# Altium project Atmega328p_Breakout.PrjPcb
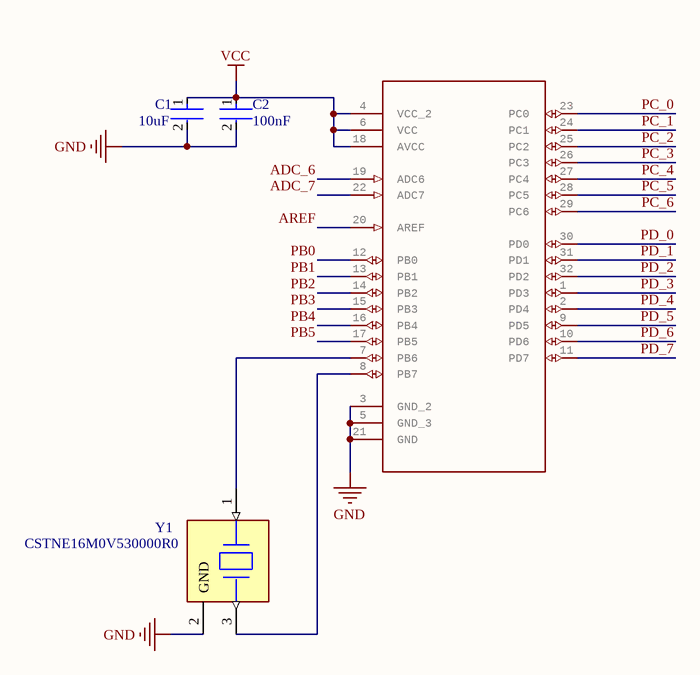
[diagram p0: Atmega328p_Breakout.SchDoc]
1 sheet, 4 parts. Net scope: global (net labels, ports and power ports of the same name join across sheets).
Board file: Atmega328p_Breakout.PcbDoc

## Sheet Atmega328p_Breakout.SchDoc
size A; SheetNumber: 1; SheetTotal: 1

### Parts
C1  10uF  [FP-CC0805-0_85-MFG]
C2  100nF  [FP-CC0805-0_85-MFG]
U1  ATMEL-ATMEGA328P-AU_ATMEGA328P-AU  [ATMEL-ATMEGA328P-AU_QFP80P900X900X120-32N]  (value not drawn)
Y1  CSTNE16M0V530000R0  [FP-CSTNE16M0V530000R0-MFG]

### Nets
GND: C1.2 C2.2 U1.3(GND_2) U1.5(GND_3) U1.21(GND) Y1.2(GND)
VCC: C1.1 C2.1 U1.4(VCC_2) U1.6(VCC) U1.18(AVCC)
ADC_6: U1.19(ADC6)
ADC_7: U1.22(ADC7)
AREF: U1.20(AREF)
PB0: U1.12(PB0)
PB1: U1.13(PB1)
PB2: U1.14(PB2)
PB3: U1.15(PB3)
PB4: U1.16(PB4)
PB5: U1.17(PB5)
PC_0: U1.23(PC0)
PC_1: U1.24(PC1)
PC_2: U1.25(PC2)
PC_3: U1.26(PC3)
PC_4: U1.27(PC4)
PC_5: U1.28(PC5)
PC_6: U1.29(PC6)
PD_0: U1.30(PD0)
PD_1: U1.31(PD1)
PD_2: U1.32(PD2)
PD_3: U1.1(PD3)
PD_4: U1.2(PD4)
PD_5: U1.9(PD5)
PD_6: U1.10(PD6)
PD_7: U1.11(PD7)
NetU1_7: U1.7(PB6) Y1.1(Input)
NetU1_8: U1.8(PB7) Y1.3(Output)

### Library data of the parts
C1 = CMP-2100-03606-3: CAP CER 0.1UF 50V X7R 0805; Manufacturer Part Number: CC0805KRX7R9BB104; Manufacturer: Yageo; Tolerance: 0.1; Capacitance: 100 nF; Value: 100 nF; Description: CC0805 100 nF X7R 10.00% 50 V; Material: Ceramic; Device Class L1: Passive Components; ComponentLink2Description: Datasheet; Package: CC0805-0.85; Digikey Description: CAP CER 0.1UF 50V X7R 0805; Device Class L3: Ceramic Capacitors; Temperature: -30°C to +85°C; Temperature Characteristic: X7R; Voltage Rating: 50 V; Height: 0.95mm; RoHS: TRUE; Ipc Land Pattern Name: CAPC200125X85; Device Class L2: Capacitors; Category: Cap; Temperature Range Low: -30°C; Temperature Range High: +85°C; Mouser Description: Multilayer Ceramic Capacitors MLCC - SMD/SMT 100nF 50V X7R 10%; Footprint Url: http://www.yageo.com/exep/pages/download/literatures/UPY-C_GEN_24.pdf; Automotive: No; Octopart: https://octopart.com/cc0805krx7r9bb104-yageo-192993; Lead Free: Yes; ComponentLink2URL: http://www.yageo.com/documents/recent/UPY-GPHC_Y5V_6.3V-to-50V_8.pdf
C2 = CMP-2100-03606-3: CAP CER 0.1UF 50V X7R 0805; Manufacturer Part Number: CC0805KRX7R9BB104; Manufacturer: Yageo; Tolerance: 0.1; Description: CC0805 100 nF X7R 10.00% 50 V; Material: Ceramic; Device Class L1: Passive Components; ComponentLink2Description: Datasheet; Package: CC0805-0.85; Digikey Description: CAP CER 0.1UF 50V X7R 0805; Capacitance: 100 nF; Device Class L3: Ceramic Capacitors; Value: 100 nF; Temperature: -30°C to +85°C; Temperature Characteristic: X7R; Voltage Rating: 50 V; Height: 0.95mm; RoHS: TRUE; Ipc Land Pattern Name: CAPC200125X85; Device Class L2: Capacitors; Category: Cap; Temperature Range Low: -30°C; Temperature Range High: +85°C; Mouser Description: Multilayer Ceramic Capacitors MLCC - SMD/SMT 100nF 50V X7R 10%; Footprint Url: http://www.yageo.com/exep/pages/download/literatures/UPY-C_GEN_24.pdf; Automotive: No; Octopart: https://octopart.com/cc0805krx7r9bb104-yageo-192993; Lead Free: Yes; ComponentLink2URL: http://www.yageo.com/documents/recent/UPY-GPHC_Y5V_6.3V-to-50V_8.pdf
U1 = ATMEL-ATMEGA328P-AU_ATMEGA328P-AU: GateName_1: A; SymbolName_1: ATMEL-ATMEGA328P-AU_ATMEGA328P-AU; LibraryName: AmbaSat-1v1-01-NO-solar; DeviceSetName: ATMEL-ATMEGA328P-AU_ATMEGA328P-AU; Package: ATMEL-ATMEGA328P-AU_QFP80P900X900X120-32N; MPN: ATMEGA328P-AU; OC_FARNELL: 1715486; OC_NEWARK: 14R4631; PACKAGE: TQFP-32; SUPPLIER: Atmel
Y1 = CMP-06054-000001-1: CERAMIC RES 16.0000MHZ 15PF SMD; Manufacturer: Murata; Tolerance: 0.5%; Stability: 0.3%; Description: 16MHz Ceramic Resonator Built in Capacitor 15pF ±0.3% 40 Ohms -40°C ~ 85°C Surface Mount; Frequency: 16MHz; Esr: 40Ω; Lead Free: Yes; ComponentLink2URL: https://www.murata.com/en-sg/products/productdata/8801162231838/SPEC-CSTNE16M0V530000R0.pdf?1545967809000; ComponentLink2Description: Datasheet; Device Class L3: Crystals; Load Capacitance: 15pF; Temperature: -40°C to +85°C; Temperature Range High: +85°C; Series: CSTNE_V; Mouser Description: Ceramic Resonator 16MHz ±0.5% (Tol) ±0.3% (Stability) 15pF 40Ohm 3-Pin CSMD T/R; Automotive: No; RoHS: TRUE; Device Class L2: Crystals / Oscillators; Manufacturer Part Number: CSTNE16M0V530000R0; Package: 0; Category: Crys; Device Class L1: Passive Components; Height: 1mm; Temperature Range Low: -40°C; Digikey Description: CERAMIC RES 16.0000MHZ 15PF SMD; Octopart: https://octopart.com/cstne16m0v530000r0-murata-91406924